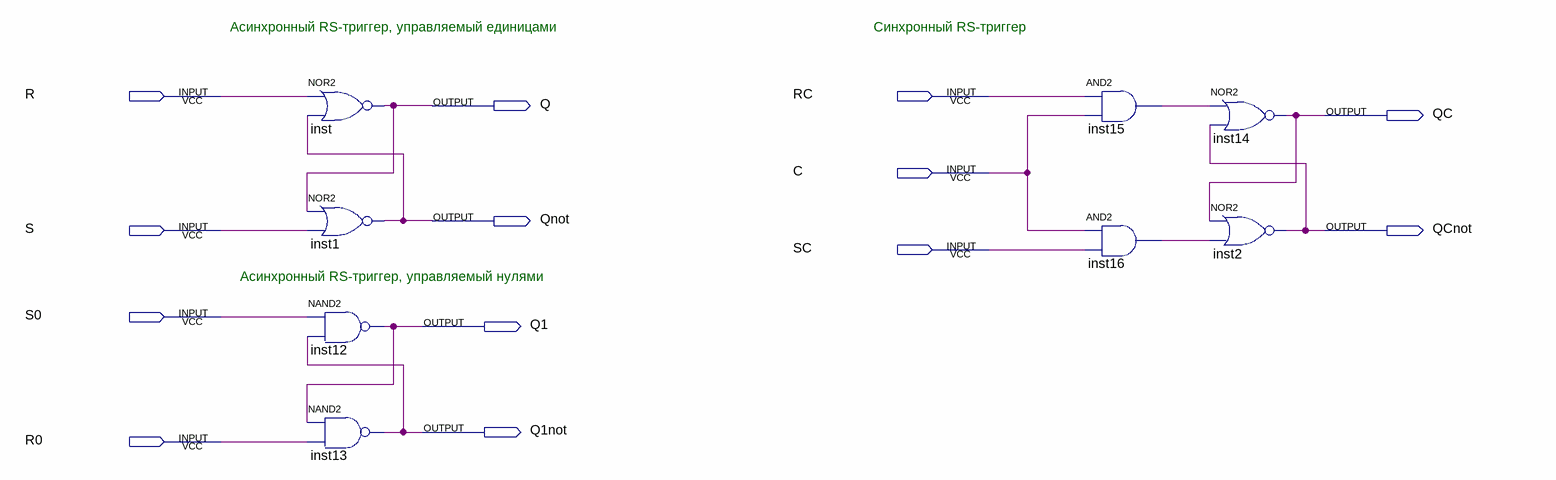
[diagram p0: schematic sheet]
// Quartus schematic CMB8.bdf as structural Verilog: 8 symbols, 13 pins
module CMB8 (
  input  R,
  input  RC,
  input  C,
  input  S,
  input  SC,
  input  S0,
  input  R0,
  output Q,
  output QC,
  output Qnot,
  output QCnot,
  output Q1,
  output Q1not
);

  wire inst15_out, inst16_out;

  nor inst (Q, R, Qnot);
  nor inst1 (Qnot, Q, S);
  nand inst12 (Q1, S0, Q1not);
  nand inst13 (Q1not, Q1, R0);
  and inst15 (inst15_out, RC, C);
  and inst16 (inst16_out, C, SC);
  nor inst14 (QC, inst15_out, QCnot);
  nor inst2 (QCnot, QC, inst16_out);

  // Notes on the sheet:
  //   Асинхронный RS-триггер, управляемый единицами
  //   Синхронный RS-триггер
  //   Асинхронный RS-триггер, управляемый нулями
endmodule
